# EAGLE design 914-STM32 (EAGLE 9.6.2)
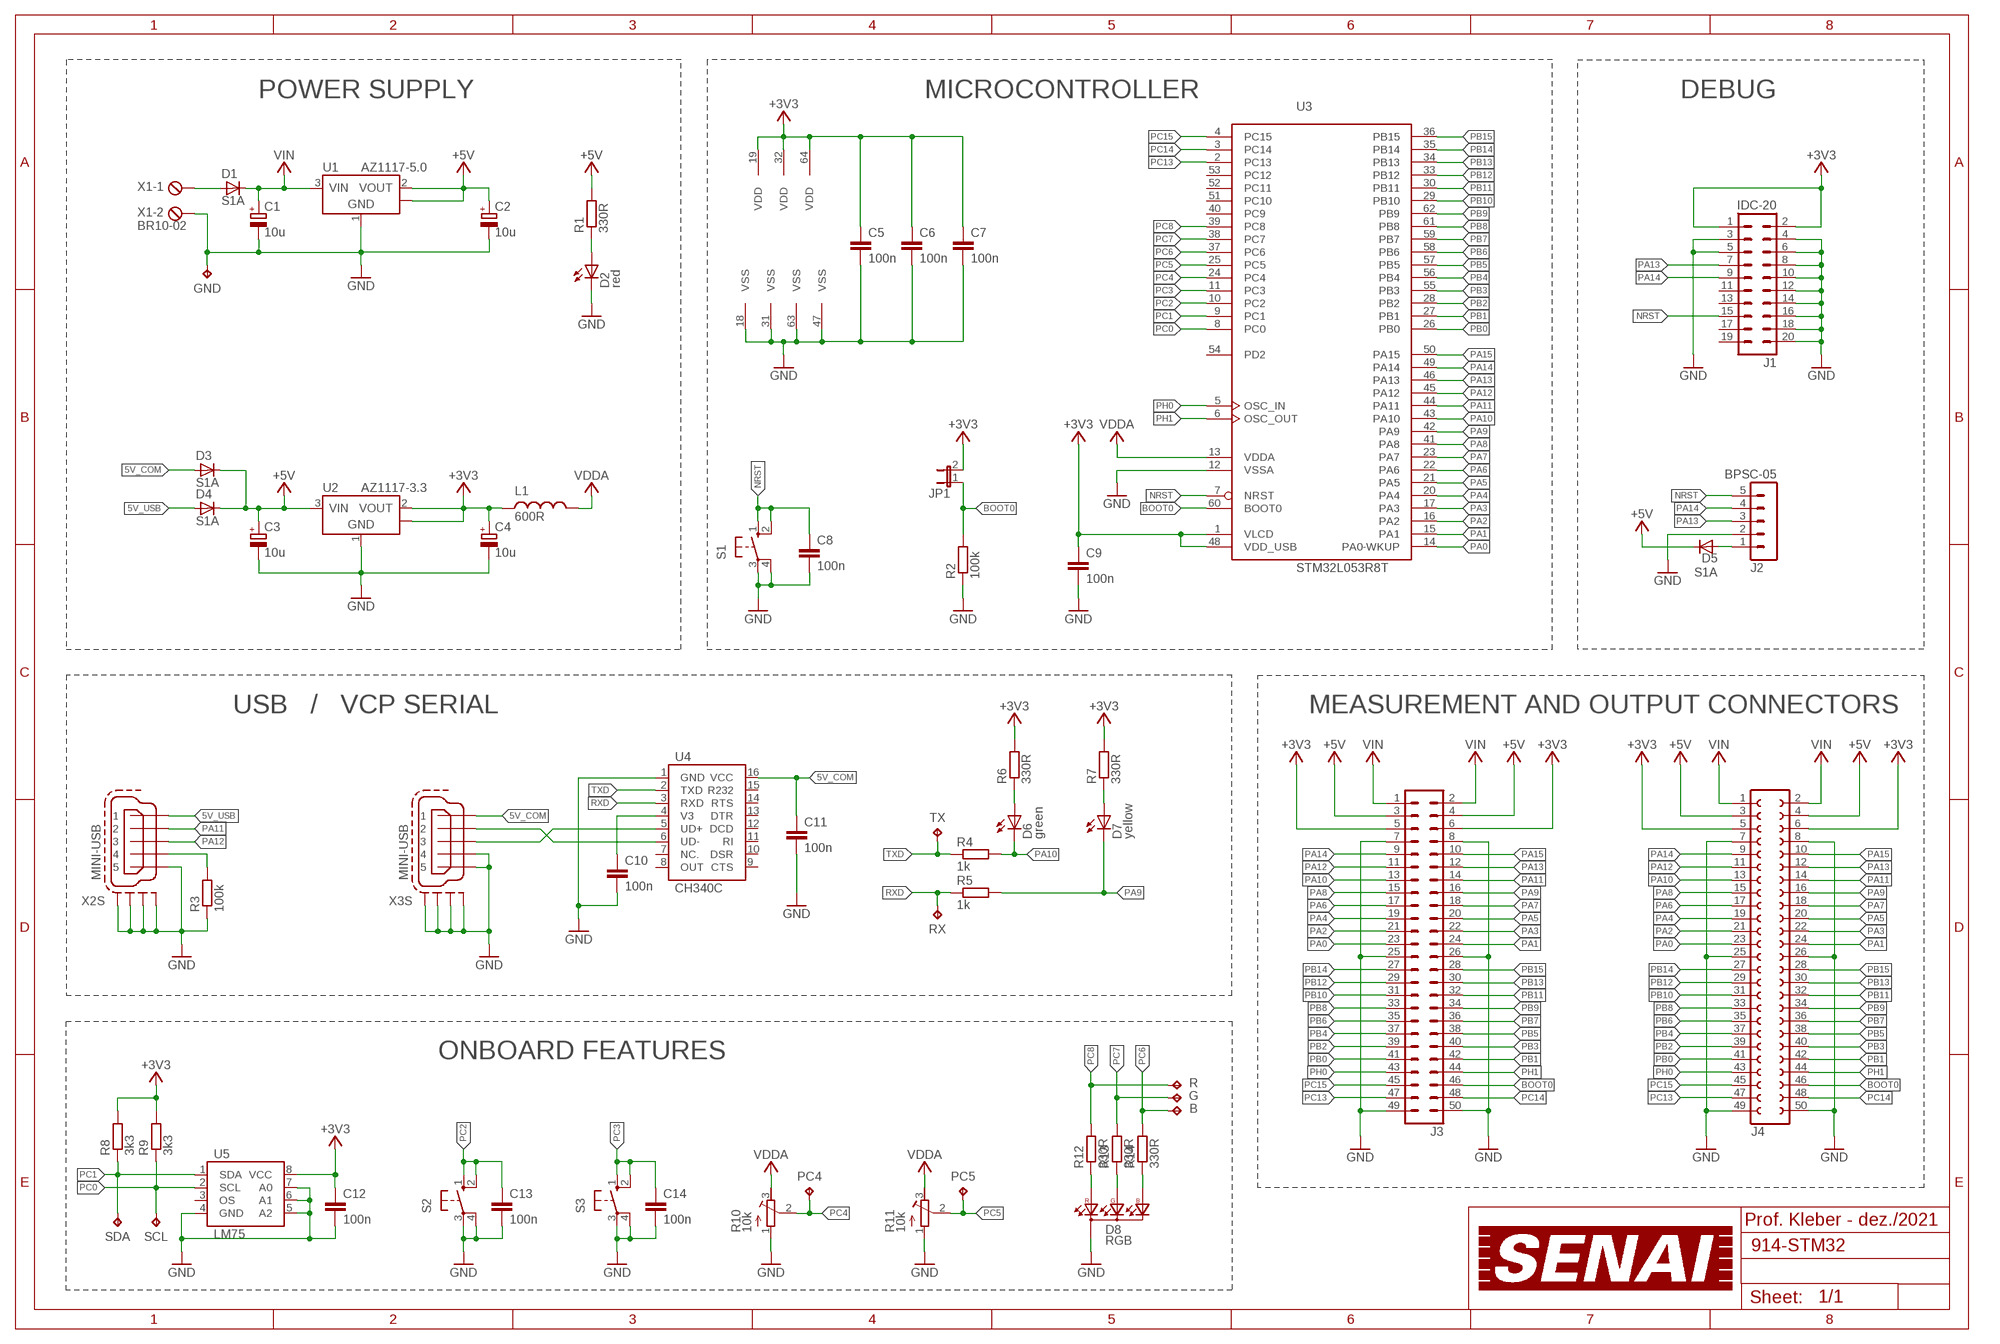
[diagram p0: schematic, sheet 1]

## Parts
1  GND  TP  [TP1]
2  SDA  TP  [TP1]
3  RX  TP  [TP1]
C1  10u  CPOL-1206  [CT1206]
C2  10u  CPOL-1206  [CT1206]
C3  10u  CPOL-1206  [CT1206]
C4  10u  CPOL-1206  [CT1206]
C5  100n  C-0603  [C0603]
C6  100n  C-0603  [C0603]
C7  100n  C-0603  [C0603]
C8  100n  C-0603  [C0603]
C9  100n  C-0603  [C0603]
C10  100n  C-0603  [C0603]
C11  100n  C-0603  [C0603]
C12  100n  C-0603  [C0603]
C13  100n  C-0603  [C0603]
C14  100n  C-0603  [C0603]
D1  S1A  D-SMA  [DO214AC]
D2  red  LED-0805  [LED-0805]
D3  S1A  D-SMA  [DO214AC]
D4  S1A  D-SMA  [DO214AC]
D5  S1A  D-SMA  [DO214AC]
D6  green  LED-0805  [LED-0805]
D7  yellow  LED-0805  [LED-0805]
D8  RGB  LED-RGB-CC  [LED-RGB-5MM]
J1  IDC-20  ML20  [ML20]
J2  BPSC-05  CON-BPSC-05  [BPSC-05]
J3  MA25-2  [MA25-2]
J4  FE25-2  [FE25-2]
JP1  JP1E  [JP1]
L1  600R  L-0603  [L0603]
R1  330R  R-0603  [R0603]
R2  100k  R-0603  [R0603]
R3  100k  R-0603  [R0603]
R4  1k  R-0603  [R0603]
R5  1k  R-0603  [R0603]
R6  330R  R-0603  [R0603]
R7  330R  R-0603  [R0603]
R8  3k3  R-0603  [R0603]
R9  3k3  R-0603  [R0603]
R10  10k  R-TRIMM3386F  [RTRIM3386F]
R11  10k  R-TRIMM3386F  [RTRIM3386F]
R12  330R  R-0603  [R0603]
R13  330R  R-0603  [R0603]
R14  330R  R-0603  [R0603]
S1  10-XX  [B3F-10XX]
S2  10-XX  [B3F-10XX]
S3  10-XX  [B3F-10XX]
TP1  R  TP  [TP1]
TP2  G  TP  [TP1]
TP3  SCL  TP  [TP1]
TP4  PC4  TP  [TP1]
TP5  PC5  TP  [TP1]
TP6  B  TP  [TP1]
TP7  TX  TP  [TP1]
U1  AZ1117-5.0  V-REG  [SOT223]
U2  AZ1117-3.3  V-REG  [SOT223]
U3  STM32L053R8T  [LQFP64]
U4  CH340C  [SOIC16]
U5  LM75  [SOIC8]
X1  BR10-02  [BR10-02]
X2  MINI-USB  MINI-USB-SCHIELD-32005-201  [32005-201]
X3  MINI-USB  MINI-USB-SCHIELD-32005-201  [32005-201]

## Nets
5V_COM [power]: C11.1 D3.A U4.16(VCC) X3.1
5V_USB [power]: D4.A X2.1
+3V3 [power]: C4.+ C5.1 C6.1 C7.1 C9.1 C12.1 J1.1 J1.2 J3.5 J3.6 J4.5 J4.6 JP1.2 L1.2 R6.2 R7.2 R8.2 R9.2 U2.2(VOUT) U2.4(TAB) U3.1(VLCD) U3.19(VDD) U3.32(VDD) U3.48(VDD_USB) U3.64(VDD) U5.8(VCC)
+5V [power]: C2.+ C3.+ D3.C D4.C D5.C J3.3 J3.4 J4.3 J4.4 R1.2 U1.2(VOUT) U1.4(TAB) U2.3(VIN)
A_B: D8.4(ABLUE) R14.1
A_G: D8.3(AGREEN) R13.1
A_ON: D2.A R1.1
A_ON1: D6.A R6.1
A_ON2: D7.A R7.1
A_R: D8.1(ARED) R12.1
BOOT0: J3.46 J4.46 JP1.1 R2.2 U3.60(BOOT0)
GND [power]: 1.TP C1.- C2.- C3.- C4.- C5.2 C6.2 C7.2 C8.2 C9.2 C10.2 C11.2 C12.2 C13.2 C14.2 D2.C D8.2(C2) J1.3 J1.4 J1.5 J1.6 J1.8 J1.10 J1.12 J1.14 J1.16 J1.18 J1.20 J2.2 J3.7 J3.8 J3.25 J3.26 J3.49 J3.50 J4.7 J4.8 J4.25 J4.26 J4.49 J4.50 R2.1 R3.1 R10.1(A) R11.1(A) S1.3(P) S1.4(P1) S2.3(P) S2.4(P1) S3.3(P) S3.4(P1) U1.1(GND) U2.1(GND) U3.12(VSSA) U3.18(VSS) U3.31(VSS) U3.47(VSS) U3.63(VSS) U4.1(GND) U5.4(GND) U5.5(A2) U5.6(A1) U5.7(A0) X1.2 X2.5 X2.M1(S:S1) X2.M2(S:S2) X2.M3(S:S3) X2.M4(S:S4) X3.4 X3.5 X3.M1(S:S1) X3.M2(S:S2) X3.M3(S:S3) X3.M4(S:S4)
NRST: C8.1 J1.15 J2.5 S1.1(S) S1.2(S1) U3.7(NRST)
PA0: J3.23 J4.23 U3.14(PA0-WKUP)
PA1: J3.24 J4.24 U3.15(PA1)
PA2: J3.21 J4.21 U3.16(PA2)
PA3: J3.22 J4.22 U3.17(PA3)
PA4: J3.19 J4.19 U3.20(PA4)
PA5: J3.20 J4.20 U3.21(PA5)
PA6: J3.17 J4.17 U3.22(PA6)
PA7: J3.18 J4.18 U3.23(PA7)
PA8: J3.15 J4.15 U3.41(PA8)
PA9: D7.C J3.16 J4.16 R5.2 U3.42(PA9)
PA10: D6.C J3.13 J4.13 R4.2 U3.43(PA10)
PA11: J3.14 J4.14 U3.44(PA11) X2.2
PA12: J3.11 J4.11 U3.45(PA12) X2.3
PA13: J1.7 J2.3 J3.12 J4.12 U3.46(PA13)
PA14: J1.9 J2.4 J3.9 J4.9 U3.49(PA14)
PA15: J3.10 J4.10 U3.50(PA15)
PB0: J3.41 J4.41 U3.26(PB0)
PB1: J3.42 J4.42 U3.27(PB1)
PB2: J3.39 J4.39 U3.28(PB2)
PB3: J3.40 J4.40 U3.55(PB3)
PB4: J3.37 J4.37 U3.56(PB4)
PB5: J3.38 J4.38 U3.57(PB5)
PB6: J3.35 J4.35 U3.58(PB6)
PB7: J3.36 J4.36 U3.59(PB7)
PB8: J3.33 J4.33 U3.61(PB8)
PB9: J3.34 J4.34 U3.62(PB9)
PB10: J3.31 J4.31 U3.29(PB10)
PB11: J3.32 J4.32 U3.30(PB11)
PB12: J3.29 J4.29 U3.33(PB12)
PB13: J3.30 J4.30 U3.34(PB13)
PB14: J3.27 J4.27 U3.35(PB14)
PB15: J3.28 J4.28 U3.36(PB15)
PC0: R9.1 TP3.TP U3.8(PC0) U5.2(SCL)
PC1: 2.TP R8.1 U3.9(PC1) U5.1(SDA)
PC2: C13.1 S2.1(S) S2.2(S1) U3.10(PC2)
PC3: C14.1 S3.1(S) S3.2(S1) U3.11(PC3)
PC4: R10.2(S) TP4.TP U3.24(PC4)
PC5: R11.2(S) TP5.TP U3.25(PC5)
PC6: R14.2 TP6.TP U3.37(PC6)
PC7: R13.2 TP2.TP U3.38(PC7)
PC8: R12.2 TP1.TP U3.39(PC8)
PC13: J3.47 J4.47 U3.2(PC13)
PC14: J3.48 J4.48 U3.3(PC14)
PC15: J3.45 J4.45 U3.4(PC15)
PH0: J3.43 J4.43 U3.5(OSC_IN)
PH1: J3.44 J4.44 U3.6(OSC_OUT)
RXD: 3.TP R5.1 U4.3(RXD)
SWD_5V [power]: D5.A J2.1
TXD: R4.1 TP7.TP U4.2(TXD)
UD+: U4.5(UD+) X3.3
UD-: U4.6(UD-) X3.2
USB_ID: R3.2 X2.4
V3: C10.1 U4.4(V3)
VDDA [power]: L1.1 R10.3(E) R11.3(E) U3.13(VDDA)
VIN [power]: C1.+ D1.C J3.1 J3.2 J4.1 J4.2 U1.3(VIN)
VIN_CONN [power]: D1.A X1.1
Unconnected: J1.11 J1.13 J1.17 J1.19 U3.40(PC9) U3.51(PC10) U3.52(PC11) U3.53(PC12) U3.54(PD2) U4.7(NC.) U4.8(OUT) U4.9(CTS) U4.10(DSR) U4.11(RI) U4.12(DCD) U4.13(DTR) U4.14(RTS) U4.15(R232) U5.3(OS)

## Notes on the sheet
- POWER SUPPLY | MICROCONTROLLER | DEBUG
- USB   /   VCP SERIAL | MEASUREMENT AND OUTPUT CONNECTORS
- ONBOARD FEATURES
- Prof. Kleber - dez./2021

## Library data of the parts
1-3 TP1-TP7 = 914-Eagle-Libraries:TP
C1-C4 = 914-Eagle-Libraries:CPOL-: CAPACITOR
C5-C14 = 914-Eagle-Libraries:C-: CAPACITOR
D1 D3-D5 = 914-Eagle-Libraries:D-
D2 D6 D7 = 914-Eagle-Libraries:LED-: LED
D8 = 914-Eagle-Libraries:LED-RGB-CC
J1 = con-harting-ml:ML20: HARTING; OC_FARNELL: unknown; OC_NEWARK: unknown
J2 = 914-Eagle-Libraries:CON-?05
J3 = 914-Eagle-Libraries:MA25-2: PIN HEADER; OC_FARNELL: unknown; OC_NEWARK: unknown
J4 = 914-Eagle-Libraries:FE25-2: FEMALE HEADER
JP1 = 914-Eagle-Libraries:JP1E: JUMPER
L1 = 914-Eagle-Libraries:L-: INDUCTOR / FERRITE BEAD
R1-R9 R12-R14 = 914-Eagle-Libraries:R-: RESISTOR
R10 R11 = 914-Eagle-Libraries:R-TRIMM
S1-S3 = switch-omron:10-XX: OMRON SWITCH; MPN: B3F-1000; OC_FARNELL: 176432; OC_NEWARK: 36M3542
U1 U2 = 914-Eagle-Libraries:V-REG: Linear Voltage Regulator
U3 = micro-stm_v3:STM32L053R*T: ARM 32-bit Cortex™-M0+ CPU 32 MHz maximum frequency 32 to 64 Kbytes of Flash memory 2 kbyte of Data EEPROM 8 kbytes of SRAM 51 GPIOs 1.8 to 3.6 V application supply
U4 = 914-Eagle-Libraries:CH340C
U5 = 914-Eagle-Libraries:LM75
X1 = 914-Eagle-Libraries:BR10-02: Terminal Block Metaltex BR10 Pitch 5.00mm
X2 X3 = con-cypressindustries:MINI-USB-SCHIELD-: MINI USB-B Conector Source: www.cypressindustries.com; OC_FARNELL: unknown; OC_NEWARK: unknown

## Board
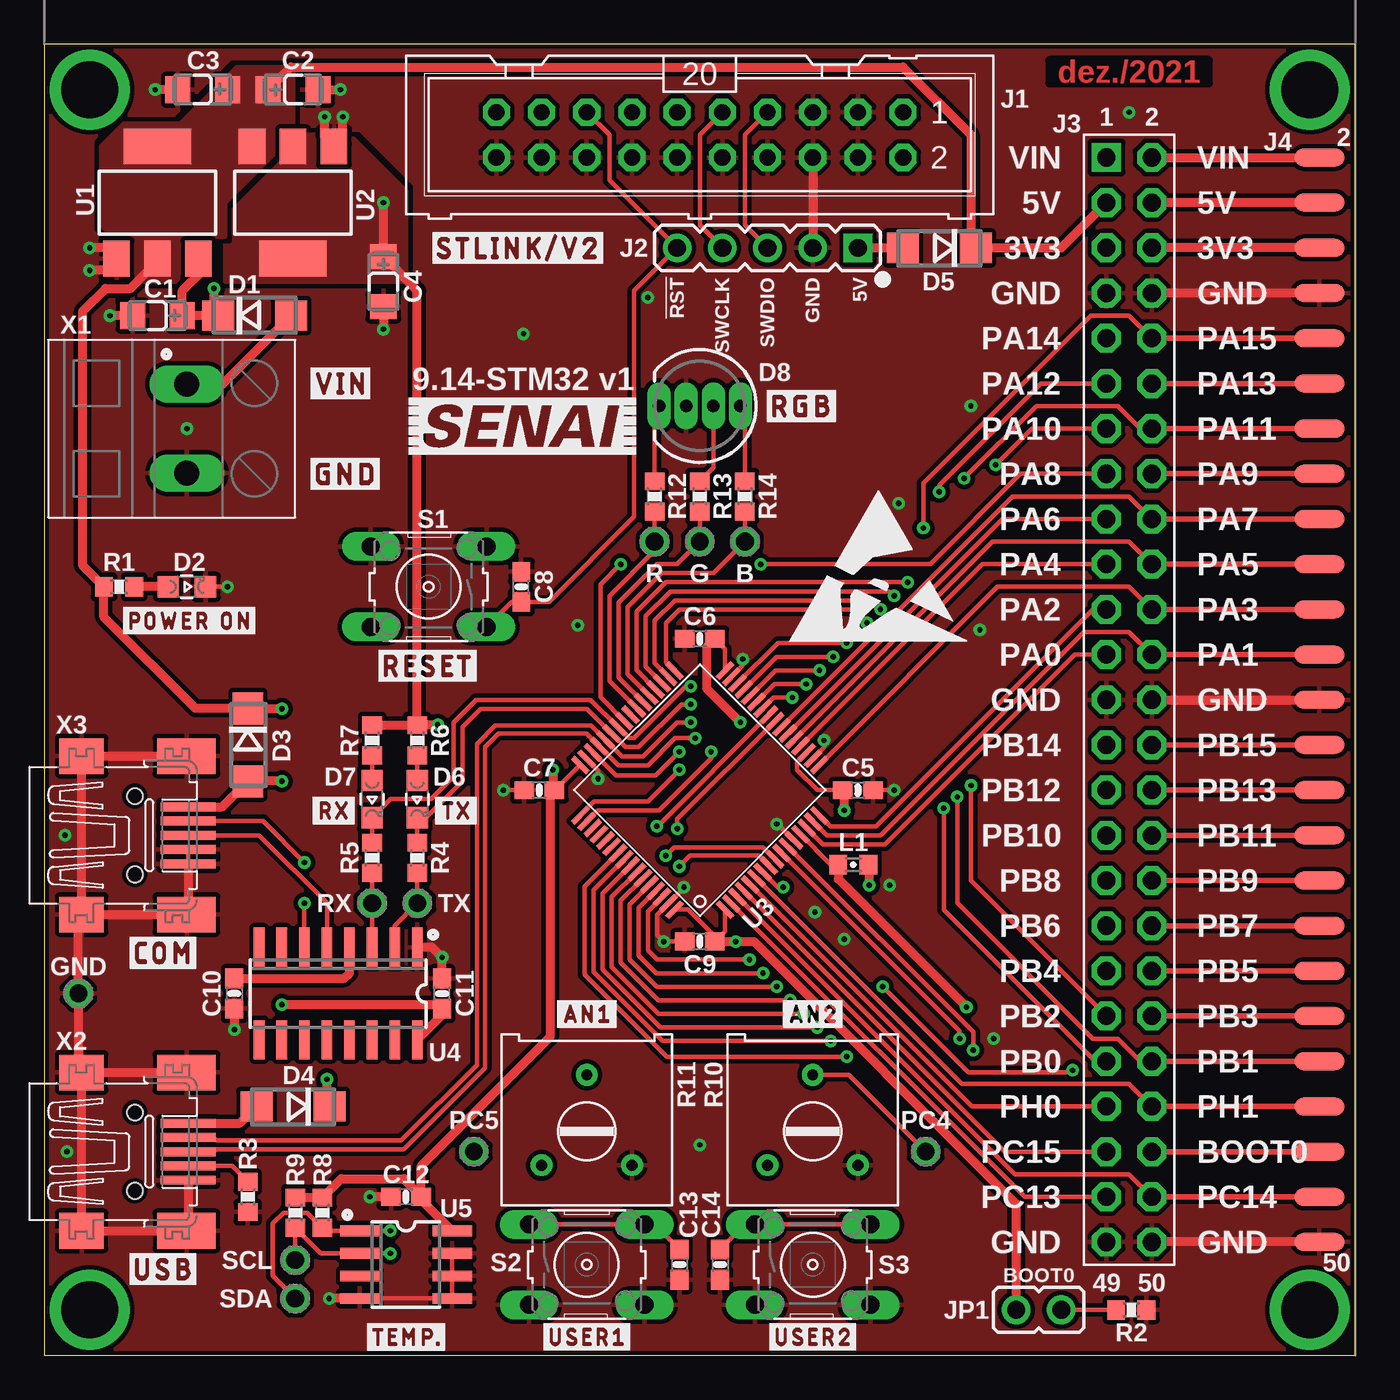
[diagram p1: board, top side]
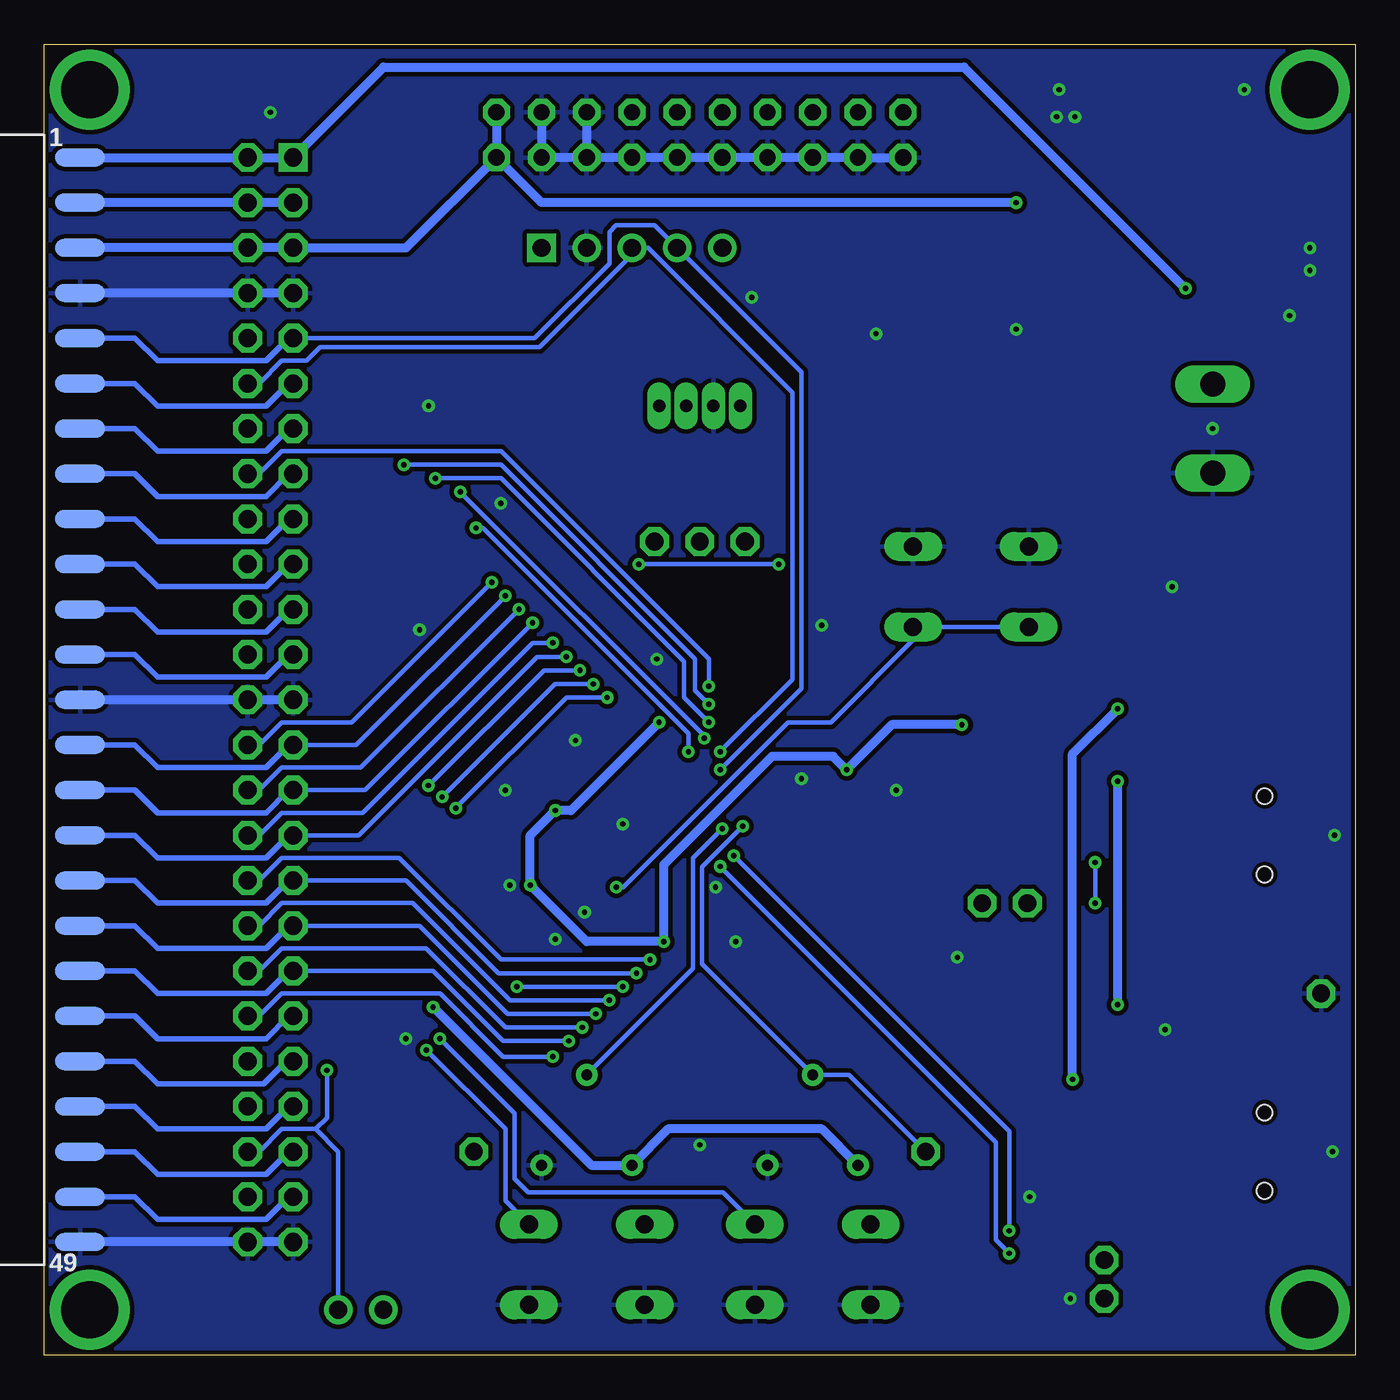
[diagram p2: board, bottom side, seen from below]

Size 73.66 x 73.66 mm. Coordinates in mm from the lower left corner, seen from the top.
Outline: 0,0 73.66,0 73.66,73.66 0,73.66 0,0
Copper layers (1*16): Top 0.035mm / dielectric 1.5mm / Bottom 0.035mm
Design rules "default *": minimum track width 8mil, minimum drill 0.3mm, track to track 8mil, track to pad 8mil, pad to pad 7mil, via to via 8mil, smd to smd 8mil, copper to edge 10mil, drill to drill 6mil, minimum pad ring 12mil, minimum via ring 8mil, stop-mask expansion 4mil, vias tented up to drill 12mil, thermal gap 10mil

### Footprints (pad centres in the part's own frame; a part is rotated, then mirrored left to right if it is on the bottom)
TP1 = drill 1 pad 1.6 octagon: TP 0,0
CT1206 = smd 1.4 x 1.5: + -1.4,0; - 1.4,0
C0603 = smd 1.1 x 1: 1 -0.85,0; 2 0.85,0
DO214AC = smd 1.8 x 1.7: A 2.05,0; C -2.05,0
LED-0805 = smd 1.2 x 1.2: A 0,-1.05; C 0,1.05
LED-RGB-5MM = drill 0.7 long: 1 -2.286,0; 2 -0.762,0; 3 0.762,0; 4 2.286,0
ML20 = drill 0.914 octagon: 1 -11.43,-1.27; 2 -11.43,1.27; 3 -8.89,-1.27; 4 -8.89,1.27; 5 -6.35,-1.27; 6 -6.35,1.27; 7 -3.81,-1.27; 8 -3.81,1.27; 9 -1.27,-1.27; 10 -1.27,1.27; 11 1.27,-1.27; 12 1.27,1.27; 13 3.81,-1.27; 14 3.81,1.27; 15 6.35,-1.27; 16 6.35,1.27; 17 8.89,-1.27; 18 8.89,1.27; 19 11.43,-1.27; 20 11.43,1.27
BPSC-05 = drill 1 pad 1.6 square: 1 5.08,0 | drill 1 pad 1.6: 2 2.54,0; 3 0,0; 4 -2.54,0; 5 -5.08,0
MA25-2 = drill 1.016 square: 1 -30.48,-1.27 | drill 1.016 octagon: 2 -30.48,1.27; 3 -27.94,-1.27; 4 -27.94,1.27; 5 -25.4,-1.27; 6 -25.4,1.27; 7 -22.86,-1.27; 8 -22.86,1.27; 9 -20.32,-1.27; 10 -20.32,1.27; 11 -17.78,-1.27; 12 -17.78,1.27; 13 -15.24,-1.27; 14 -15.24,1.27; 15 -12.7,-1.27; 16 -12.7,1.27; 17 -10.16,-1.27; 18 -10.16,1.27; 19 -7.62,-1.27; 20 -7.62,1.27; 21 -5.08,-1.27; 22 -5.08,1.27; 23 -2.54,-1.27; 24 -2.54,1.27; 25 0,-1.27; 26 0,1.27; 27 2.54,-1.27; 28 2.54,1.27; 29 5.08,-1.27; 30 5.08,1.27; 31 7.62,-1.27; 32 7.62,1.27; 33 10.16,-1.27; 34 10.16,1.27; 35 12.7,-1.27; 36 12.7,1.27; 37 15.24,-1.27; 38 15.24,1.27; 39 17.78,-1.27; 40 17.78,1.27; 41 20.32,-1.27; 42 20.32,1.27; 43 22.86,-1.27; 44 22.86,1.27; 45 25.4,-1.27; 46 25.4,1.27; 47 27.94,-1.27; 48 27.94,1.27; 49 30.48,-1.27; 50 30.48,1.27
FE25-2 = smd 1 x 2.8: 1 30.48,-2; 3 27.94,-2; 5 25.4,-2; 7 22.86,-2; 9 20.32,-2; 11 17.78,-2; 13 15.24,-2; 15 12.7,-2; 17 10.16,-2; 19 7.62,-2; 21 5.08,-2; 23 2.54,-2; 25 0,-2; 27 -2.54,-2; 29 -5.08,-2; 31 -7.62,-2; 33 -10.16,-2; 35 -12.7,-2; 37 -15.24,-2; 39 -17.78,-2; 41 -20.32,-2; 43 -22.86,-2; 45 -25.4,-2; 47 -27.94,-2; 49 -30.48,-2 | smd 1 x 2.8 bottom: 2 30.48,-2; 4 27.94,-2; 6 25.4,-2; 8 22.86,-2; 10 20.32,-2; 12 17.78,-2; 14 15.24,-2; 16 12.7,-2; 18 10.16,-2; 20 7.62,-2; 22 5.08,-2; 24 2.54,-2; 26 0,-2; 28 -2.54,-2; 30 -5.08,-2; 32 -7.62,-2; 34 -10.16,-2; 36 -12.7,-2; 38 -15.24,-2; 40 -17.78,-2; 42 -20.32,-2; 44 -22.86,-2; 46 -25.4,-2; 48 -27.94,-2; 50 -30.48,-2
JP1 = drill 1 pad 1.6: 1 0,-1.27; 2 0,1.27
L0603 = smd 1 x 1.1: 1 -0.85,0; 2 0.85,0
R0603 = smd 1 x 1.1: 1 -0.85,0; 2 0.85,0
RTRIM3386F = drill 0.61: 1 -2.54,2.54; 2 0,-2.54; 3 2.54,2.54
B3F-10XX = drill 1.016 long: 1 -3.251,2.261; 2 3.251,2.261; 3 -3.251,-2.261; 4 3.251,-2.261
SOT223 = smd 1.5 x 2: 1 -2.3,-3.15; 2 0,-3.15; 3 2.3,-3.15 | smd 3.8 x 2: 4 0,3.15
LQFP64 = smd 0.3 x 1.2: 1 -3.75,-5.75; 2 -3.25,-5.75; 3 -2.75,-5.75; 4 -2.25,-5.75; 5 -1.75,-5.75; 6 -1.25,-5.75; 7 -0.75,-5.75; 8 -0.25,-5.75; 9 0.25,-5.75; 10 0.75,-5.75; 11 1.25,-5.75; 12 1.75,-5.75; 13 2.25,-5.75; 14 2.75,-5.75; 15 3.25,-5.75; 16 3.75,-5.75; 33 3.75,5.75; 34 3.25,5.75; 35 2.75,5.75; 36 2.25,5.75; 37 1.75,5.75; 38 1.25,5.75; 39 0.75,5.75; 40 0.25,5.75; 41 -0.25,5.75; 42 -0.75,5.75; 43 -1.25,5.75; 44 -1.75,5.75; 45 -2.25,5.75; 46 -2.75,5.75; 47 -3.25,5.75; 48 -3.75,5.75 | smd 1.2 x 0.3: 17 5.75,-3.75; 18 5.75,-3.25; 19 5.75,-2.75; 20 5.75,-2.25; 21 5.75,-1.75; 22 5.75,-1.25; 23 5.75,-0.75; 24 5.75,-0.25; 25 5.75,0.25; 26 5.75,0.75; 27 5.75,1.25; 28 5.75,1.75; 29 5.75,2.25; 30 5.75,2.75; 31 5.75,3.25; 32 5.75,3.75; 49 -5.75,3.75; 50 -5.75,3.25; 51 -5.75,2.75; 52 -5.75,2.25; 53 -5.75,1.75; 54 -5.75,1.25; 55 -5.75,0.75; 56 -5.75,0.25; 57 -5.75,-0.25; 58 -5.75,-0.75; 59 -5.75,-1.25; 60 -5.75,-1.75; 61 -5.75,-2.25; 62 -5.75,-2.75; 63 -5.75,-3.25; 64 -5.75,-3.75
SOIC16 = smd 0.6 x 2.2: 1 -4.445,-2.6; 2 -3.175,-2.6; 3 -1.905,-2.6; 4 -0.635,-2.6; 5 0.635,-2.6; 6 1.905,-2.6; 7 3.175,-2.6; 8 4.445,-2.6; 9 4.445,2.6; 10 3.175,2.6; 11 1.905,2.6; 12 0.635,2.6; 13 -0.635,2.6; 14 -1.905,2.6; 15 -3.175,2.6; 16 -4.445,2.6
SOIC8 = smd 0.6 x 2.2: 1 -1.905,-2.6; 2 -0.635,-2.6; 3 0.635,-2.6; 4 1.905,-2.6; 5 1.905,2.6; 6 0.635,2.6; 7 -0.635,2.6; 8 -1.905,2.6
BR10-02 = drill 1.4 long: 1 -2.5,0; 2 2.5,0
32005-201 = smd 3.1 x 0.5: 1 3,1.6; 2 3,0.8; 3 3,0; 4 3,-0.8; 5 3,-1.6 | smd 2.5 x 2: M1 -3,-4.45; M2 -3,4.45 | smd 3.3 x 2: M3 2.9,4.45; M4 2.9,-4.45 | hole 0.9: 0,2.2; 0,-2.2

### Placement (x,y rotation side)
1  1.91,20.32 180 top
2  14.1,3.17 0 top
3  18.41,25.4 0 top
C1  6.35,58.42 180 top
C2  13.97,71.12 0 top
C3  8.89,71.12 180 top
C4  19.05,60.33 270 top
C5  45.72,31.75 0 top
C6  36.83,40.26 180 top
C7  27.81,31.75 180 top
C8  26.8,43.18 90 top
C9  36.83,23.24 180 top
C10  10.67,20.32 270 top
C11  22.35,20.32 90 top
C12  20.32,8.89 180 top
C13  35.69,5.08 270 top
C14  37.97,5.08 270 top
D1  11.81,58.42 0 top
D2  8,43.18 270 top
D3  11.43,34.29 270 top
D4  13.97,13.97 180 top
D5  50.29,62.23 180 top
D6  20.95,31.24 180 top
D7  18.41,31.24 180 top
D8  36.83,53.34 0 top
J1  36.83,68.58 180 top
J2  40.64,62.23 0 top
J3  60.96,36.83 270 top
J4  73.66,36.83 90 bottom
JP1  55.88,2.54 90 top
L1  45.47,27.56 0 top
R1  4.19,43.18 180 top
R2  61.09,2.54 180 top
R3  11.43,8.89 90 top
R4  20.95,27.94 90 top
R5  18.41,27.94 90 top
R6  20.95,34.54 90 top
R7  18.41,34.54 90 top
R8  15.62,8 90 top
R9  14.1,8 90 top
R10  43.18,13.21 180 top
R11  30.48,13.21 180 top
R12  34.29,48.26 270 top
R13  36.83,48.26 270 top
R14  39.37,48.26 270 top
S1  21.59,43.18 180 top
S2  30.48,5.08 0 top
S3  43.18,5.08 0 top
TP1  34.29,45.72 180 top
TP2  36.83,45.72 180 top
TP3  14.1,5.33 0 top
TP4  49.53,11.43 0 top
TP5  24.13,11.43 0 top
TP6  39.37,45.72 180 top
TP7  20.95,25.4 0 top
U1  6.35,64.77 0 top
U2  13.97,64.77 180 top
U3  36.83,31.75 45 top
U4  16.51,20.32 180 top
U5  20.32,5.08 270 top
U$1  [ESD_10.00]  41.78,40.01 0 top
X1  8,52.07 270 top
X2  5.08,11.43 0 top
X3  5.08,29.21 0 top

### Tracks (layer width: path | path; a pad name or v marks a point on that pad's centre or on a via)
5V_COM  (via drill 0.3)
  Top 0.508: X3.1 10,30.81 D3.A 11.45,32.26 v13.34,32.26 | U4.16 22.35,19.12 C11.1 22.14,19.68 v13.34,19.68
  Bottom 0.508: v13.34,19.68 v13.34,32.26
5V_USB
  Top 0.508: X2.1 10.98,13.03 D4.A
+3V3  (via drill 0.3)
  Top 0.254: U3.1 38.24,23.8 C9.1 37.68,23.53 36.18,25.03 U3.64 | C5.1 43.43,31.75 42.29,32.89 42.29,33.32 U3.19 | C6.1 38.24,39.7 U3.32 | C7.1 28.7,31.75 U3.48
  Top 0.508: J4.6 J3.6 | C12.1 21.17,8.73 U5.8 | C9.1 v38.86,23.24 39.88,23.24 54.61,8.51 JP1.2 | v19.05,64.77 C4.+ 20.95,59.82 R6.2 | R6.2 R7.2 | R9.2 R8.2 16.68,9.91 20.19,9.91 21.17,8.93 C12.1 | v46.35,26.42 46.35,27.52 L1.2 | v44.96,30.61 44.96,31.66 C5.1 | R6.2 20.99,35.43 v22.1,35.43 | v28.57,32.89 28.57,31.84 C7.1 28.41,31.5 28.41,17.87 21.17,10.63 C12.1 | C6.1 37.21,39.79 37.21,37.47 v39.12,35.56
  Bottom 0.508: J4.6 J3.6 J3.5 53.34,62.23 J1.2 | J1.1 J1.2 | v19.05,64.77 45.72,64.77 J1.2 | v22.1,35.43 26.04,35.43 v28.57,32.89 29.34,33.66 32.77,33.66 38.86,27.56 v38.86,23.24 43.18,23.24 v46.35,26.42 46.35,29.21 v44.96,30.61 44.07,30.61 v39.12,35.56
  pour Top (isolate 0.254, rank 2, no thermals): 12.7,68.58 17.14,68.58 20.32,65.41 20.32,60.33 10.16,60.33 10.16,64.77 12.7,67.31
+5V  (via drill 0.3)
  Top 0.508: J4.4 J3.4 | J3.3 57.15,62.23 D5.C 52.07,62.5 52.07,68.58 48.26,72.39 13.84,72.39 C2.+ | D4.C 15.88,14.12 v15.88,15.49 | v13.34,36.32 11.45,36.32 D3.C 8.49,36.34 3.34,41.49 R1.2 2.16,44.36 2.16,58.67 3.43,59.94 4.83,59.94 6.35,61.47 U1.2
  Bottom 0.508: J3.3 J3.4 J4.4 | v15.88,15.49 15.88,33.78 v13.34,36.32
  pour Top (isolate 0.254, no thermals): 5.08,60.33 7.62,60.33 7.62,62.87 10.16,62.87 10.16,64.77 13.97,68.58 13.97,72.39 10.79,72.39 7.62,69.22 4.45,69.22 3.17,67.94 3.17,63.5 5.08,61.59
A_B
  Top 0.254: R14.1 39.37,53.09 D8.4
A_G
  Top 0.254: R13.1 37.59,49.87 D8.3
A_ON
  Top 0.508: D2.A R1.1
A_ON1
  Top 0.254: D6.A R6.1
A_ON2
  Top 0.254: D7.A R7.1
A_R
  Top 0.254: R12.1 34.29,53.09 D8.1
BOOT0  (via drill 0.3)
  Top 0.254: JP1.1 R2.2 | U3.60 32.89,25.34 32.89,22.23 34.42,20.7 v41.15,20.7 | v47.12,20.7 51.94,15.88 57.66,15.88 v57.78,16
  Top 0.305: J3.46 J4.46
  Bottom 0.254: JP1.1 57.15,11.43 58.42,12.7 | 58.42,12.7 60.33,12.7 61.59,11.43 J3.46 | v47.12,20.7 v41.15,20.7 | v57.78,16 57.78,13.34 58.42,12.7
GND  (via drill 0.3)
  Top 0.254: C9.2 v34.8,23.24 34.42,23.62 34.42,24.74 U3.63 35.94,26.27 v35.94,26.29 | C5.2 v47.75,31.75 | C6.2 35.98,40.01 | C7.2 v25.78,31.75 | U3.31 39.24,38.76 v39.24,39.12 | U3.18 43.81,34.14 v43.81,34.54 | U3.12 41.21,29.84 v41.15,29.84 | D2.C v10.29,43.18 | X3.5 X3.4 | U5.7 U5.6 U5.5 U5.4 | v31.11,32.38 31.11,32.87 U3.47
  Top 0.508: J4.8 J3.8 | J3.26 J4.26 | J4.50 J3.50 | X2.M2 X2.M3 | X2.5 8.08,7.08 X2.M4 X2.M1 X2.M2 | X3.M1 X3.M4 8.08,24.86 X3.5 | X3.M3 X3.M2 X3.M1 | J1.6 J2.2 | C3.- v6.22,71.12 | C2.- v16.64,71.12 | v2.54,62.23 3.44,62.23 U1.1 3.42,60.98 2.56,60.98 v2.54,60.96 | C1.- v3.68,58.42 | C4.- v19.05,57.66 | v15.75,69.6 15.75,68.45 U2.1 16.31,67.96 16.65,67.96 16.76,68.07 v16.76,69.6 | X3.M1 1.91,24.59 1.TP 1.91,16.05 X2.M2 | C11.2 v22.35,22.35 21.78,22.92 U4.1 | C12.2 v18.29,8.89 | U5.4 v16,3.17 | C10.2 v10.67,18.29
  Bottom 0.508: J3.7 J3.8 J4.8 | J3.25 J3.26 J4.26 | J3.49 J3.50 J4.50 | J1.6 J1.8 J1.10 J1.12 J1.14 J1.16 J1.18 J1.20 | J1.6 J1.4 J1.3 | J1.5 J1.6
  other vias: 52.58,40.77 36.83,11.81 48.01,47.88 29.97,41.02 33.91,59.44 43.31,24.89 44.96,23.37 47.5,26.42 53.34,17.78 26.92,57.4 1.27,11.43 1.14,29.21 8,52.07 60.96,69.85 52.07,53.34
  pour Bottom (isolate 0.254): 0,0 76.2,0 76.2,76.2 0,76.2
  pour Top (isolate 0.254, rank 3): 76.2,0 0,0 0,76.2 76.2,76.2
M1  (via drill 3.2 pad 4.5)
  other vias: 2.54,2.54
M2  (via drill 3.2 pad 4.5)
  other vias: 2.54,71.12
M3  (via drill 3.2 pad 4.5)
  other vias: 71.12,71.12
M4  (via drill 3.2 pad 4.5)
  other vias: 71.12,2.54
NRST  (via drill 0.3)
  Top 0.254: S1.1 26.25,42.33 C8.1 28.36,42.33 33.15,47.12 33.15,59.82 J2.5 31.75,66.04 31.75,68.58 J1.15 | U3.7 41.23,26.29 v41.53,26.29
  Bottom 0.254: S1.2 S1.1 24.84,40.18 29.46,35.56 31.88,35.56 41.15,26.29 v41.53,26.29
PA0
  Top 0.254: U3.14 43.77,28.7 47.24,28.7 57.91,39.37 J3.23
  Bottom 0.305: J3.23 59.94,39.37 61.21,38.1 67.31,38.1 68.58,39.37 J4.23
PA1
  Top 0.254: U3.15 43.97,29.21 46.99,29.21 58.42,40.64 60.96,40.64 J3.24
  Top 0.305: J4.24 J3.24
PA2
  Top 0.254: U3.16 44.16,29.72 46.74,29.72 58.93,41.91 J3.21
  Bottom 0.305: J3.21 59.94,41.91 61.21,40.64 67.31,40.64 68.58,41.91 J4.21
PA3
  Top 0.254: U3.17 53.56,43.18 60.96,43.18 J3.22
  Top 0.305: J3.22 J4.22
PA4
  Top 0.254: U3.20 52.71,44.45 J3.19
  Bottom 0.305: J3.19 59.94,44.45 61.21,43.18 67.31,43.18 68.58,44.45 J4.19
PA5
  Top 0.254: U3.21 53.27,45.72 60.96,45.72 J3.20
  Top 0.305: J4.20 J3.20
PA6
  Top 0.254: U3.22 53.84,46.99 J3.17
  Bottom 0.305: J3.17 59.94,46.99 61.21,45.72 67.31,45.72 68.58,46.99 J4.17
PA7
  Top 0.254: U3.23 54.4,48.26 60.96,48.26 J3.18
  Top 0.305: J3.18 J4.18
PA8  (via drill 0.3)
  Top 0.254: U3.41 31.24,36.98 31.24,43.31 v32.38,44.45 | v40.26,44.45 49.78,44.45 54.86,49.53 J3.15
  Bottom 0.254: v32.38,44.45 v40.26,44.45
  Bottom 0.305: J3.15 59.94,49.53 61.21,48.26 67.31,48.26 68.58,49.53 J4.15
PA9  (via drill 0.3)
  Top 0.254: R5.2 D7.C 19.46,31.24 21.72,31.24 22.99,32.51 22.99,35.56 24.26,36.83 30.69,36.83 U3.42 32.85,34.67 33.15,34.67 36.07,37.59 v36.32,37.59
  Top 0.305: J4.16 J3.16
  Bottom 0.254: J3.16 61.59,49.53 60.33,50.8 48.01,50.8 36.32,39.12 v36.32,37.59
PA10  (via drill 0.3)
  Top 0.254: D6.C R4.2 20.95,29.72 23.5,32.26 23.5,35.31 24.51,36.32 30.49,36.32 U3.43 32.65,34.16 33.4,34.16 35.81,36.58 v36.32,36.58 | v53.47,50.04 55.5,52.07 J3.13
  Bottom 0.254: v36.32,36.58 37.08,37.34 37.08,39.12 48.01,50.04 v53.47,50.04
  Bottom 0.305: J3.13 59.94,52.07 61.21,50.8 67.31,50.8 68.58,52.07 J4.13
PA11  (via drill 0.3)
  Top 0.254: v36.32,35.56 35.56,35.56 33.66,33.66 32.45,33.66 U3.44 30.72,35.38 25.34,35.38 24.31,34.35 24.31,16.32 20.05,12.06 9.64,12.06 9.48,12.23 X2.2 | v51.69,49.28 55.75,53.34 60.33,53.34 61.59,52.07 J3.14
  Top 0.305: J3.14 J4.14
  Bottom 0.254: v36.32,35.56 37.72,36.96 37.72,38.99 48.01,49.28 v51.69,49.28
PA12  (via drill 0.3)
  Top 0.254: v36.58,34.67 35.43,34.67 33.91,33.15 32.25,33.15 U3.45 30.47,34.92 25.53,34.92 24.77,34.16 24.77,16.13 20.19,11.56 9.65,11.56 9.53,11.43 X2.3 | v50.29,48.51 50.29,48.9 56.01,54.61 J3.11
  Bottom 0.254: v36.58,34.67 36.58,34.8 v50.29,48.51
  Bottom 0.305: J3.11 59.94,54.61 61.21,53.34 67.31,53.34 68.58,54.61 J4.11
PA13  (via drill 0.3)
  Top 0.254: J1.7 39.37,68.58 39.37,63.5 J2.3 | U3.46 32.13,32.56 34.34,32.56 v35.69,33.91
  Top 0.305: J4.12 J3.12
  Bottom 0.254: J3.12 61.59,54.61 60.33,55.88 58.93,55.88 58.17,56.64 45.85,56.64 40.64,61.85 J2.3 39.75,62.23 31.62,54.1 31.62,37.97 v35.69,33.91
PA14  (via drill 0.3)
  Top 0.254: J1.9 36.83,68.58 36.83,63.5 J2.4 | U3.49 30.89,31.11 33.91,31.11 v35.69,32.89
  Bottom 0.254: J3.9 46.1,57.15 41.91,61.34 41.91,63.12 41.53,63.5 39.37,63.5 J2.4 31.11,55.24 31.11,37.47 v35.69,32.89
  Bottom 0.305: J3.9 59.94,57.15 61.21,55.88 67.31,55.88 68.58,57.15 J4.9
PA15  (via drill 0.3)
  Top 0.254: U3.50 31.09,30.61 34.54,30.61 37.47,33.53 v37.47,33.91 | v49.4,46.48 49.4,49.02 58.8,58.42 60.96,58.42 J3.10
  Top 0.305: J3.10 J4.10
  Bottom 0.254: v37.47,33.91 37.47,34.92 49.02,46.48 v49.4,46.48
PB0  (via drill 0.3)
  Top 0.254: J3.41 59.05,16.51 50.55,25.02 v50.55,30.73 | U3.26 40.98,36.96 v42.04,36.96
  Bottom 0.254: v42.04,36.96 44.32,36.96 v50.55,30.73
  Bottom 0.305: J3.41 60.07,16.51 61.34,15.24 67.31,15.24 68.58,16.51 J4.41
PB1  (via drill 0.3)
  Top 0.254: J3.42 61.59,16.51 60.33,17.78 58.93,17.78 51.31,25.4 v51.31,31.37 | U3.27 41.02,37.71 v42.81,37.71
  Top 0.305: J3.42 J4.42
  Bottom 0.254: v42.81,37.71 44.97,37.71 v51.31,31.37
PB2  (via drill 0.3)
  Top 0.254: U3.28 40.61,38 41.09,38.48 v43.56,38.48 | v52.08,32.01 v52.07,32 52.07,26.67 J3.39
  Bottom 0.254: v43.56,38.48 45.59,38.48 52.06,32.01 v52.08,32.01
  Bottom 0.305: J3.39 59.94,19.05 61.21,17.78 67.31,17.78 68.58,19.05 J4.39
PB3  (via drill 0.3)
  Top 0.254: U3.55 30.35,26.33 30.35,21.39 34.98,16.76 v45.09,16.76
  Top 0.305: J3.40 J4.40
  Bottom 0.254: v45.09,16.76 47.88,16.76 51.44,20.32 60.33,20.32 61.59,19.05 J3.40
PB4  (via drill 0.3)
  Top 0.254: U3.56 30.86,26.14 30.86,21.53 34.74,17.65 v44.2,17.65
  Bottom 0.254: v44.2,17.65 47.88,17.65 51.82,21.59 J3.37
  Bottom 0.305: J3.37 59.94,21.59 61.21,20.32 67.31,20.32 68.58,21.59 J4.37
PB5  (via drill 0.3)
  Top 0.254: U3.57 31.37,25.93 31.37,21.67 34.62,18.41 v43.43,18.41
  Top 0.305: J3.38 J4.38
  Bottom 0.254: v43.43,18.41 47.75,18.41 52.2,22.86 60.33,22.86 61.59,21.59 J3.38
PB6  (via drill 0.3)
  Top 0.254: U3.58 31.88,25.74 31.88,21.81 34.51,19.18 v42.67,19.18
  Bottom 0.254: v42.67,19.18 47.62,19.18 52.58,24.13 J3.35
  Bottom 0.305: J3.35 59.94,24.13 61.21,22.86 67.31,22.86 68.58,24.13 J4.35
PB7  (via drill 0.3)
  Top 0.254: U3.59 32.38,25.54 32.38,22.07 34.52,19.94 v41.91,19.94
  Top 0.305: J4.36 J3.36
  Bottom 0.254: v41.91,19.94 47.5,19.94 52.96,25.4 60.33,25.4 61.59,24.13 J3.36
PB8  (via drill 0.3)
  Top 0.254: U3.61 33.4,25.14 33.4,22.47 34.41,21.46 v40.39,21.46
  Bottom 0.254: v40.39,21.46 48.13,21.46 53.34,26.67 J3.33
  Bottom 0.305: J3.33 59.94,26.67 61.21,25.4 67.31,25.4 68.58,26.67 J4.33
PB9  (via drill 0.3)
  Top 0.254: U3.62 33.91,24.94 33.91,22.73 34.42,22.23 v39.62,22.23
  Top 0.305: J3.34 J4.34
  Bottom 0.254: v39.62,22.23 48.01,22.23 53.72,27.94 60.33,27.94 61.59,26.67 J3.34
PB10  (via drill 0.3)
  Top 0.254: v44.32,39.24 41.14,39.24 U3.29
  Bottom 0.254: J3.31 56.01,29.21 45.97,39.24 v44.32,39.24
  Bottom 0.305: J3.31 59.94,29.21 61.21,27.94 67.31,27.94 68.58,29.21 J4.31
PB11  (via drill 0.3)
  Top 0.254: v45.09,40.03 41.22,40.03 U3.30
  Top 0.305: J4.32 J3.32
  Bottom 0.254: J3.32 61.59,29.21 60.33,30.48 55.77,30.48 46.23,40.03 v45.09,40.03
PB12  (via drill 0.3)
  Top 0.254: U3.33 34.92,38.96 34.92,41.15 35.69,41.91 45.47,41.91 v46.23,41.15
  Bottom 0.254: J3.29 55.63,31.75 v46.23,41.15
  Bottom 0.305: J3.29 59.94,31.75 61.21,30.48 67.31,30.48 68.58,31.75 J4.29
PB13  (via drill 0.3)
  Top 0.254: U3.34 34.29,38.89 34.29,41.27 35.43,42.42 46.48,42.42 v46.99,41.91
  Top 0.305: J4.30 J3.30
  Bottom 0.254: J3.30 61.59,31.75 60.33,33.02 55.88,33.02 v46.99,41.91
PB14  (via drill 0.3)
  Top 0.254: U3.35 33.78,38.69 33.78,41.53 35.18,42.93 47.5,42.93 v47.75,42.67
  Bottom 0.254: v47.75,42.67 56.13,34.29 J3.27
  Bottom 0.305: J3.27 59.94,34.29 61.21,33.02 67.31,33.02 68.58,34.29 J4.27
PB15  (via drill 0.3)
  Top 0.254: U3.36 33.27,38.49 33.27,41.78 34.92,43.43 v48.51,43.43
  Top 0.305: J3.28 J4.28
  Bottom 0.254: J3.28 61.59,34.29 60.33,35.56 57.28,35.56 56.39,35.56 v48.51,43.43
PC0  (via drill 0.3)
  Top 0.254: TP3.TP R9.1 15.53,5.71 U5.2 v19.43,5.71 | U3.8 40.16,28.07 36.29,28.07 v35.69,27.46
  Bottom 0.254: v19.43,5.71 20.19,6.48 20.19,11.97 v35.69,27.46
PC1  (via drill 0.3)
  Top 0.254: 2.TP 12.83,4.45 12.83,7.4 13.43,8 14.77,8 R8.1 15.79,6.99 U5.1 v19.43,6.99 | U3.9 41.05,27.86 40.38,28.52 35.38,28.52 v34.92,28.07
  Bottom 0.254: v34.92,28.07 19.43,12.57 v19.43,6.99
PC2  (via drill 0.3)
  Top 0.254: S2.1 S2.2 34.28,7.34 C13.1 | U3.10 51.44,18.21 v51.44,17.78
  Bottom 0.254: v51.44,17.78 47.24,13.59 47.24,9.91 46.48,9.14 35.53,9.14 S2.2
PC3  (via drill 0.3)
  Top 0.254: S3.2 S3.1 39.38,7.34 C14.1 | U3.11 52.2,18.15 v52.2,17.14
  Bottom 0.254: v52.2,17.14 47.75,12.7 47.75,8.66 S3.2
PC4  (via drill 0.3)
  Top 0.254: U3.24 35.56,30.13 v35.56,29.59 | TP4.TP 45.21,15.75 R10.2
  Bottom 0.254: v35.56,29.59 37.21,27.94 37.21,21.72 R10.2
PC5  (via drill 0.3)
  Top 0.254: U3.25 34.44,29.72 v34.42,29.72
  Bottom 0.254: TP5.TP 28.45,15.75 R11.2 36.7,21.97 36.7,27.43 v34.42,29.72
PC6
  Top 0.254: U3.37 32.77,38.29 32.77,42.04 34.67,43.94 37.59,43.94 TP6.TP R14.2
PC7
  Top 0.254: U3.38 32.26,38.09 32.26,42.29 34.42,44.45 35.56,44.45 TP2.TP R13.2
PC8
  Top 0.254: U3.39 31.75,37.89 31.75,42.67 34.29,45.21 TP1.TP R12.2
PC13
  Top 0.254: U3.2 55.09,8.89 J3.47
  Bottom 0.305: J3.47 59.94,8.89 61.21,7.62 67.31,7.62 68.58,8.89 J4.47
PC14
  Top 0.254: U3.3 54.53,10.16 60.96,10.16 J3.48
  Top 0.305: J3.48 J4.48
PC15
  Top 0.254: U3.4 53.97,11.43 J3.45
  Bottom 0.305: J3.45 59.94,11.43 61.21,10.16 67.31,10.16 68.58,11.43 J4.45
PH0
  Top 0.254: U3.5 52.13,13.97 J3.43
  Bottom 0.305: J3.43 59.94,13.97 61.21,12.7 67.31,12.7 68.58,13.97 J4.43
PH1
  Top 0.254: U3.6 51.57,15.24 60.96,15.24 J3.44
  Top 0.305: J3.44 J4.44
RXD
  Top 0.254: U4.3 3.TP R5.1
SWD_5V
  Top 0.508: J2.1 D5.A
TXD
  Top 0.254: U4.2 19.68,24.13 TP7.TP R4.1
UD+
  Top 0.254: X3.3 12.06,29.21 15.88,25.4 U4.5
UD-  (via drill 0.3)
  Top 0.254: X3.2 12.28,30.01 v14.61,27.69 | v14.61,25.4 U4.6
  Bottom 0.254: v14.61,27.69 v14.61,25.4
USB_ID
  Top 0.254: X2.4 10.54,10.63 R3.2
V3
  Top 0.508: C10.1 16.85,21.17 17.14,21.46 U4.4
VDDA  (via drill 0.3)
  Top 0.254: U3.13 44.2,27.56 L1.1
  Top 0.508: L1.1 44.62,26.76 v51.82,19.56
  Bottom 0.508: R11.3 29.97,12.7 38.61,12.7 R10.3 42.93,10.67 v51.82,19.56
VIN  (via drill 0.3)
  Top 0.508: J3.2 J4.2 | U1.3 8.89,61.38 8.89,60.96 7.75,59.82 C1.+ D1.C 9.53,58.66 v9.53,59.94
  Bottom 0.508: J4.2 J3.2 J3.1 54.61,72.39 21.97,72.39 v9.53,59.94
VIN_CONN
  Top 0.508: X1.1 10.01,54.57 D1.A

### Text on the board
Top: dez./2021
tPlace: VIN | VIN | 5V | 5V | 3V3 | 3V3 | !RST | SWCLK | SWDIO | GND | 5V | GND | GND | PA14 | PA15 | PA12 | PA13 | 9.14-STM32 v1 | PA10 | PA11 | PA11 | PA8 | PA9 | PA6 | PA7 | PA4 | PA5 | PA2 | PA3 | PA0 | PA1 | GND | GND | PB14 | PB15 | PB12 | PB13 | PB10 | PB11 | PB8 | PB9 | PB6 | PB7 | PB4 | PB5 | PB2 | PB3 | PB0 | PB1 | PH0 | PH1 | PC15 | BOOT0 | PC13 | PC14 | GND | GND | BOOT0